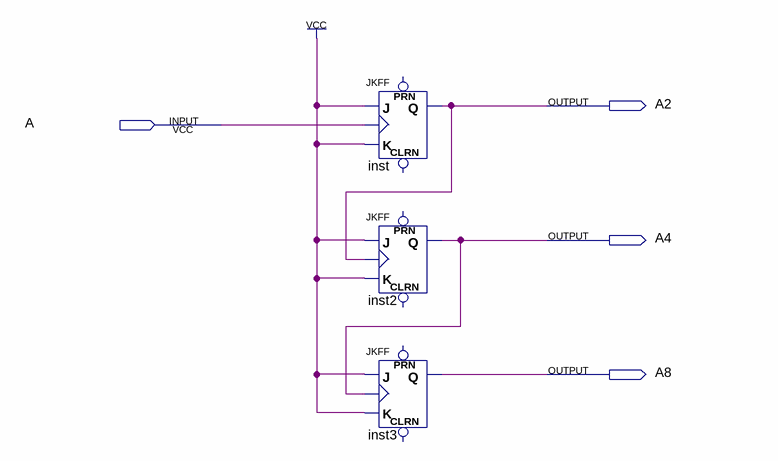
[diagram p0: schematic sheet]
// Quartus schematic divisor.bdf as structural Verilog: 3 symbols, 4 pins
module divisor (
  input  A,
  output A2,
  output A4,
  output A8
);

  JKFF inst (.K(1'b1), .J(1'b1), .CLK(A), .Q(A2));  // open: PRN, CLRN
  JKFF inst2 (.K(1'b1), .J(1'b1), .CLK(A2), .Q(A4));  // open: PRN, CLRN
  JKFF inst3 (.K(1'b1), .J(1'b1), .CLK(A4), .Q(A8));  // open: PRN, CLRN
endmodule
